# Altium schematic sheet DAC-Butterworth-LPF.SchDoc: Butterworth LPF (12MHz / 0dB)
size A4; Date: 27.09.2023; ApprovedBy: M.Sc. Tobias Wirth; CheckedBy: M.Sc. Tobias Wirth; Author: M.Sc. Tobias Wirth; CompanyName: University of Stuttgart; DrawnBy: M.Sc. Tobias Wirth; Engineer: M.Sc. Tobias Wirth; Organization: IIS; Address1: Pfaffenwaldring 47; Address2: 70569 Stuttgart; Revision: V0.1; SheetNumber: 7; SheetTotal: 17; ProjectNameAlt: AUS - NMR System; Time: 17:40; ImagePath: N/A; Application_BuildNumber: N/A
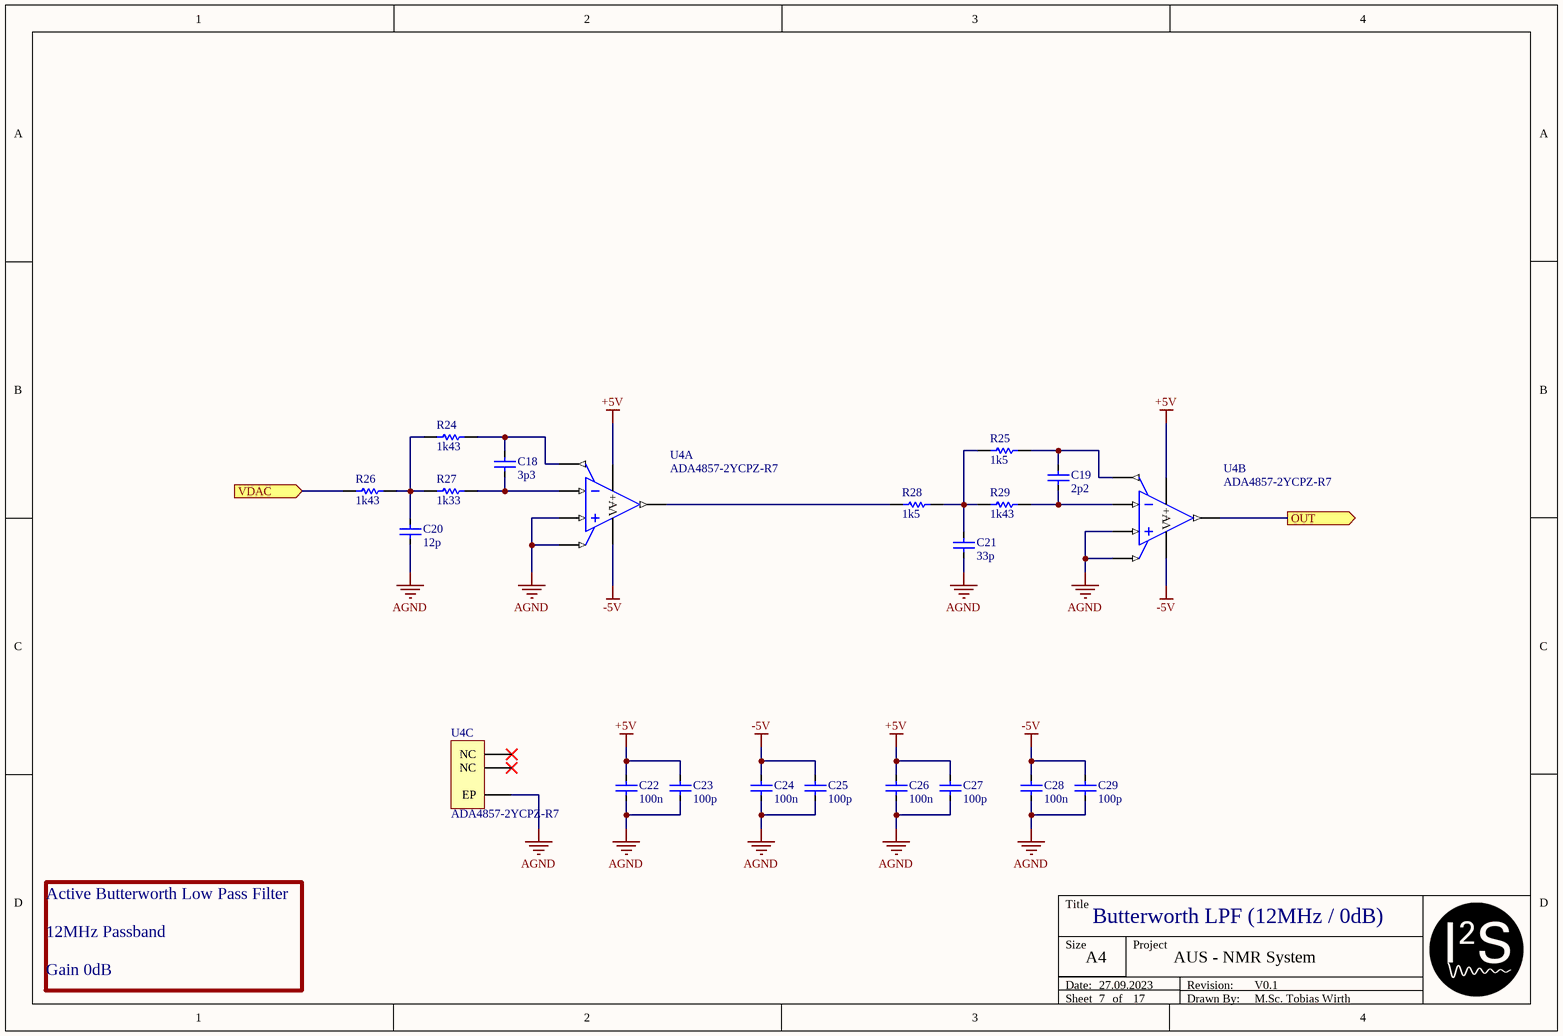
[diagram p0: DAC-Butterworth-LPF.SchDoc]

## Parts
C18  3p3  [CAP_0402]
C19  2p2  [CAP_0402]
C20  12p  [CAP_0402]
C21  33p  [CAP_0402]
C22  100n  [CAP_0402]
C23  100p  [CAP_0402]
C24  100n  [CAP_0402]
C25  100p  [CAP_0402]
C26  100n  [CAP_0402]
C27  100p  [CAP_0402]
C28  100n  [CAP_0402]
C29  100p  [CAP_0402]
R24  1k43  [RES_0402]
R25  1k5  [RES_0402]
R26  1k43  [RES_0402]
R27  1k33  [RES_0402]
R28  1k5  [RES_0402]
R29  1k43  [RES_0402]
U4  ADA4857-2YCPZ-R7  [QFN65P400X400X80_HS-17N]  (parts A,B,C of 3)

## Ports
OUT (out), VDAC (in)

## Nets
+5V: C22.1 C23.1 C26.1 C27.1 U4.6(V+) U4.14(V+)
-5V: C24.1 C25.1 C28.1 C29.1 U4.4(V−) U4.12(V−)
AGND: C20.2 C21.2 C22.2 C23.2 C24.2 C25.2 C26.2 C27.2 C28.2 C29.2 U4.2(IN1+) U4.7(PD1) U4.10(IN1+) U4.15(PD1) U4.17(EP)
OUT: U4.5(OUT2) ; port OUT
VDAC: R26.1 ; port VDAC
NetC18_1: C18.1 R24.2 U4.16(FB1)
NetC18_2: C18.2 R27.2 U4.1(IN1-)
NetC19_1: C19.1 R25.2 U4.8(FB2)
NetC19_2: C19.2 R29.2 U4.9(IN1-)
NetC20_1: C20.1 R24.1 R26.2 R27.1
NetC21_1: C21.1 R25.1 R28.2 R29.1
NetR28_1: R28.1 U4.13(OUT1)

Not connected (* = marked no-connect by the designer): U4 3(NC)* 11(NC)*

## Notes on the sheet
- Active Butterworth Low Pass Filter
  12MHz Passband
  Gain 0dB
- Title
- Size
- Date:
- Sheet
- A4
- of
- Project
- Drawn By:
- Revision:

## Library data of the parts
C18-C29 = Cap: Supplier: *; Part Number: *
  C18: Value: 3p3
  C19: Value: 2p2
  C20: Value: 12p
  C21: Value: 33p
  C22 C24 C26 C28: Value: 100n
  C23 C25 C27 C29: Value: 100p
R24-R29 = Res: Part Number: *; Supplier: *
  R24 R26 R29: Value: 1k43
  R25 R28: Value: 1k5
  R27: Value: 1k33
U4 = ADA4857-2: Ultralow Power, Low Distortion Fully Differential ADC Driver, 3 to 7 V, -40 to 125 degC, 16-Pin LFCSP_WQ (CP-24-7), RoHS, Reel; Manufacturer: Analog Devices; PartNumber: ADA4940-2ACPZ-R2; Iq/Amp: 1.25 mA Typ.; Slew Rate: 95 V/us Typ.; Test Frequency: 0.05 MHz; -3dB Bandwidth: 260 MHz Typ.; Operating Range: 3 to 7 V; ComponentLink3Description: Package Specification; ComponentLink2Description: Datasheet; RoHS: TRUE; ComponentLink2URL: http://www.analog.com/static/imported-files/data_sheets/ADA4940-1_4940-2.pdf; PackageVersion: Apr-12; DatasheetVersion: Rev. C; PackageDescription: 24-Pin Lead Frame Chip Scale Package, Body 4 x 4 mm, Pitch 0.5 mm; ComponentLink1Description: Manufacturer URL; ComponentLink1URL: http://www.analog.com/en/index.html; Packing: Reel; ComponentLink3URL: http://www.analog.com/static/imported-files/packages/PKG_PDF/LFCSP(CP)/CP_24_7.pdf; Temperature Range: -40 to 125 degC; Mounting Technology: Surface Mount; PartId: 1; Supplier 1: Mouser; Supplier Part Number 1: 584-ADA4857-2YCPZ-R7